# Altium schematic sheet Thruster Shield.SchDoc
size A
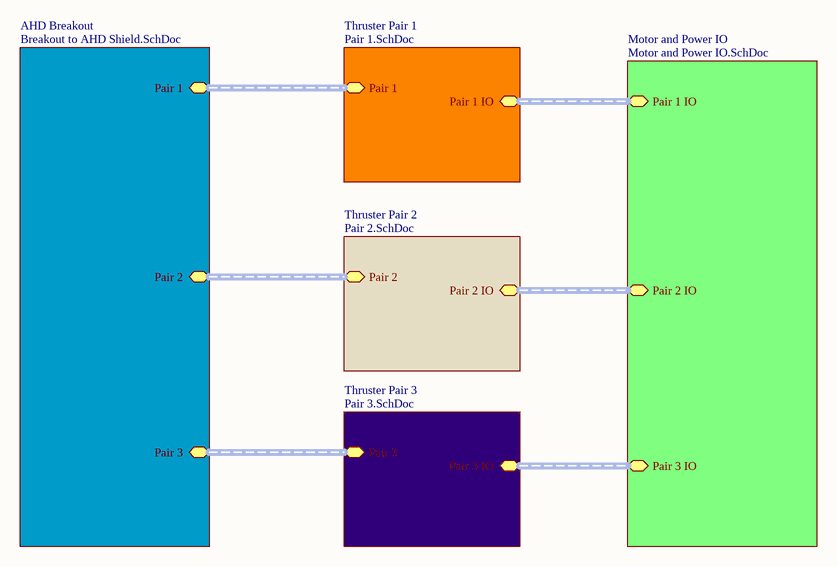
[diagram p0: Thruster Shield.SchDoc]

## Sub-sheets
AHD Breakout = Breakout to AHD Shield.SchDoc: Pair 1 (harness Pair_1_AHD), Pair 2 (harness Pair_2_AHD), Pair 3 (harness Pair_3_AHD)
Motor and Power IO = Motor and Power IO.SchDoc: Pair 1 IO (harness Pair_1_IO), Pair 2 IO (harness Pair_2_IO), Pair 3 IO (harness Pair_3_IO)
Thruster Pair 1 = Pair 1.SchDoc: Pair 1 (harness Pair_1_AHD), Pair 1 IO (harness Pair_1_IO)
Thruster Pair 2 = Pair 2.SchDoc: Pair 2 (harness Pair_2_AHD), Pair 2 IO (harness Pair_2_IO)
Thruster Pair 3 = Pair 3.SchDoc: Pair 3 (harness Pair_3_AHD), Pair 3 IO (harness Pair_3_IO)

## Buses and harness runs
harness sheet AHD Breakout/Pair 1 = sheet Thruster Pair 1/Pair 1
harness sheet AHD Breakout/Pair 2 = sheet Thruster Pair 2/Pair 2
harness sheet AHD Breakout/Pair 3 = sheet Thruster Pair 3/Pair 3
harness sheet Motor and Power IO/Pair 1 IO = sheet Thruster Pair 1/Pair 1 IO
harness sheet Motor and Power IO/Pair 2 IO = sheet Thruster Pair 2/Pair 2 IO
harness sheet Motor and Power IO/Pair 3 IO = sheet Thruster Pair 3/Pair 3 IO